# EAGLE design ResolverBoard (EAGLE 9.3.0)
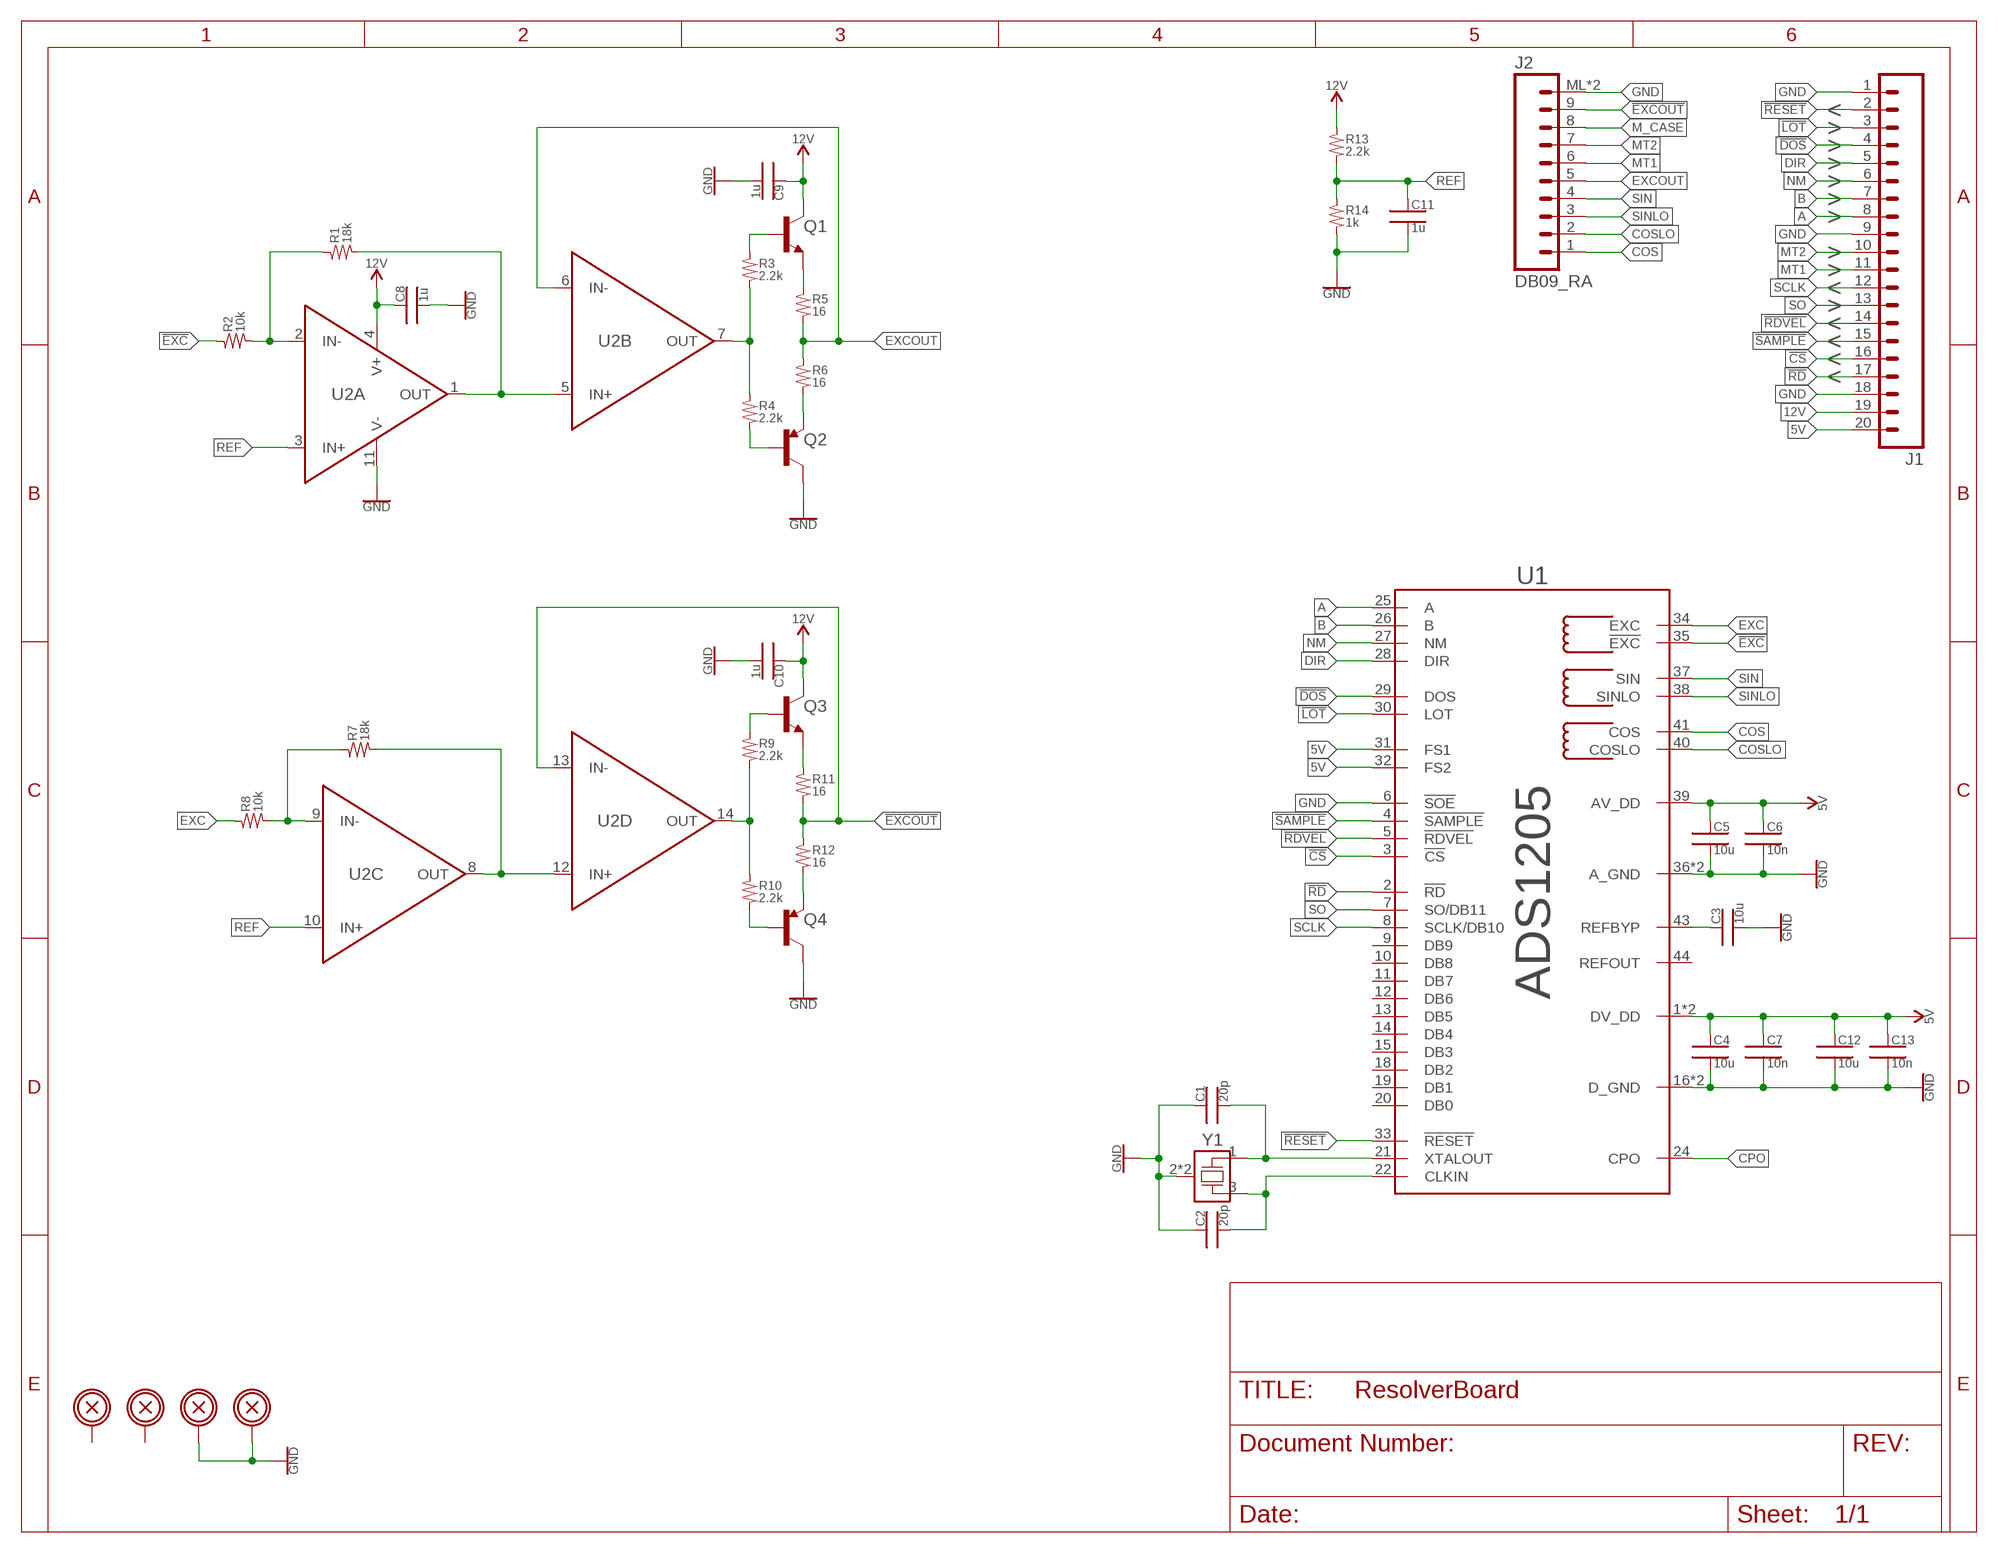
[diagram p0: schematic, sheet 1]

## Parts
C1  20p  CAP_SMD_0402  [0402]
C2  20p  CAP_SMD_0402  [0402]
C3  10u  CAP_SMD_0603  [0603]
C4  10u  CAP_SMD_0603  [0603]
C5  10u  CAP_SMD_0603  [0603]
C6  10n  CAP_SMD_0402  [0402]
C7  10n  CAP_SMD_0402  [0402]
C8  1u  CAP_SMD_0402  [0402]
C9  1u  CAP_SMD_0402  [0402]
C10  1u  CAP_SMD_0402  [0402]
C11  1u  CAP_SMD_0402  [0402]
C12  10u  CAP_SMD_0603  [0603]
C13  10n  CAP_SMD_0402  [0402]
H1  BOLTHOLE_M3  [M3_HOLE]
H2  BOLTHOLE_M3  [M3_HOLE]
H3  BOLTHOLE_M3  [M3_HOLE]
H4  BOLTHOLE_M3  [M3_HOLE]
J1  M20  [1X20]
J2  DB09_RA  [AE10921]
Q1  BJT_NPN  [SOT23-3]
Q2  BJT_PNP  [SOT23-3]
Q3  BJT_NPN  [SOT23-3]
Q4  BJT_PNP  [SOT23-3]
R1  18k  RES_SMD_0402  [0402]
R2  10k  RES_SMD_0402  [0402]
R3  2.2k  RES_SMD_0402  [0402]
R4  2.2k  RES_SMD_0402  [0402]
R5  16  RES_SMD_0805  [0805]
R6  16  RES_SMD_0805  [0805]
R7  18k  RES_SMD_0402  [0402]
R8  10k  RES_SMD_0402  [0402]
R9  2.2k  RES_SMD_0402  [0402]
R10  2.2k  RES_SMD_0402  [0402]
R11  16  RES_SMD_0805  [0805]
R12  16  RES_SMD_0805  [0805]
R13  2.2k  RES_SMD_0402  [0402]
R14  1k  RES_SMD_0402  [0402]
U1  ADS1205  [LQFP44]
U2  OPA4171D  [SOIC_14]
Y1  LFXTAL061486  [5X3.2MM_SMD_XTAL]

## Nets
5V: C4.1 C5.1 C6.1 C7.1 C12.1 C13.1 J1.20 U1.1(DV_DD) U1.17(DV_DD) U1.31(FS1) U1.32(FS2) U1.39(AV_DD)
12V: C8.1 C9.1 C10.1 J1.19 Q1.3(C) Q3.3(C) R13.1 U2.4(A:V+)
!CS: J1.16 U1.3(!CS)
!DOS: J1.4 U1.29(DOS)
!EXC: R2.1 U1.35(!EXC)
!EXCOUT: J2.9 R11.2 R12.1 U2.13(D:IN-)
!LOT: J1.3 U1.30(LOT)
!RD: J1.17 U1.2(!RD)
!RDVEL: J1.14 U1.5(!RDVEL)
!RESET: J1.2 U1.33(!RESET)
!SAMPLE: J1.15 U1.4(!SAMPLE)
A: J1.8 U1.25(A)
B: J1.7 U1.26(B)
CLKIN: C2.2 U1.22(CLKIN) Y1.3(X2)
COS: J2.1 U1.41(COS)
COSLO: J2.2 U1.40(COSLO)
CPO: U1.24(CPO)
DIR: J1.5 U1.28(DIR)
EXC: R8.1 U1.34(EXC)
EXCOUT: J2.5 R5.2 R6.1 U2.6(B:IN-)
GND: C1.1 C2.1 C3.2 C4.2 C5.2 C6.2 C7.2 C8.2 C9.2 C10.2 C11.2 C12.2 C13.2 H3.P H4.P J1.1 J1.9 J1.18 J2.ML J2.MR Q2.3(C) Q4.3(C) R14.2 U1.6(!SOE) U1.16(D_GND) U1.23(D_GND) U1.36(A_GND) U1.42(A_GND) U2.11(A:V-) Y1.2(CASE) Y1.4(CASE)
M_CASE: J2.8
MT1: J1.11 J2.6
MT2: J1.10 J2.7
NM: J1.6 U1.27(NM)
Q1BASE: Q1.1(B) R3.1
Q1EMITTER: Q1.2(E) R5.1
Q2BASE: Q2.1(B) R4.2
Q2EMITTER: Q2.2(E) R6.2
Q3BASE: Q3.1(B) R9.1
Q3EMITTER: Q3.2(E) R11.1
Q4BASE: Q4.1(B) R10.2
Q4EMITTER: Q4.2(E) R12.2
REF: C11.1 R13.2 R14.1 U2.3(A:IN+) U2.10(C:IN+)
REFBYP: C3.1 U1.43(REFBYP)
SCLK: J1.12 U1.8(SCLK/DB10)
SIN: J2.4 U1.37(SIN)
SINLO: J2.3 U1.38(SINLO)
SO: J1.13 U1.7(SO/DB11)
U2A_IN-: R1.1 R2.2 U2.2(A:IN-)
U2A_OUT: R1.2 U2.1(A:OUT) U2.5(B:IN+)
U2B_OUT: R3.2 R4.1 U2.7(B:OUT)
U2C_IN-: R7.1 R8.2 U2.9(C:IN-)
U2C_OUT: R7.2 U2.8(C:OUT) U2.12(D:IN+)
U2D_OUT: R9.2 R10.1 U2.14(D:OUT)
XTALOUT: C1.2 U1.21(XTALOUT) Y1.1(X1)
Unconnected: H1.P H2.P U1.9(DB9) U1.10(DB8) U1.11(DB7) U1.12(DB6) U1.13(DB5) U1.14(DB4) U1.15(DB3) U1.18(DB2) U1.19(DB1) U1.20(DB0) U1.44(REFOUT)

## Notes on the sheet
- <
- >
- >
- >
- >
- >
- >
- >
- >
- <
- >
- <
- <
- <
- <

## Library data of the parts
C1-C13 = FPGA_FOC_lib:CAP_SMD
H1-H4 = FPGA_FOC_lib:BOLTHOLE
J1 = FPGA_FOC_lib:M20
J2 = FPGA_FOC_lib:DB09
Q1 Q3 = FPGA_FOC_lib:BJT_NPN
Q2 Q4 = FPGA_FOC_lib:BJT_PNP: Generic NPN Bipolar transistor
R1-R14 = FPGA_FOC_lib:RES_SMD
U1 = FPGA_FOC_lib:ADS1205: AD2S1205 Resolver decoder
U2 = FPGA_FOC_lib:OPA4171: 36V 3MhzGBP Quad Opamp (datasheet) <http://www.ti.com/lit/ds/symlink/opa4171.pdf>
Y1 = FPGA_FOC_lib:LFXTAL061486: 8.192 MHz crystal, load cap=10pf (2x20pf), (datasheet) <https://www.iqdfrequencyproducts.com/products/pn/LFXTAL061486Reel.pdf>

## Board
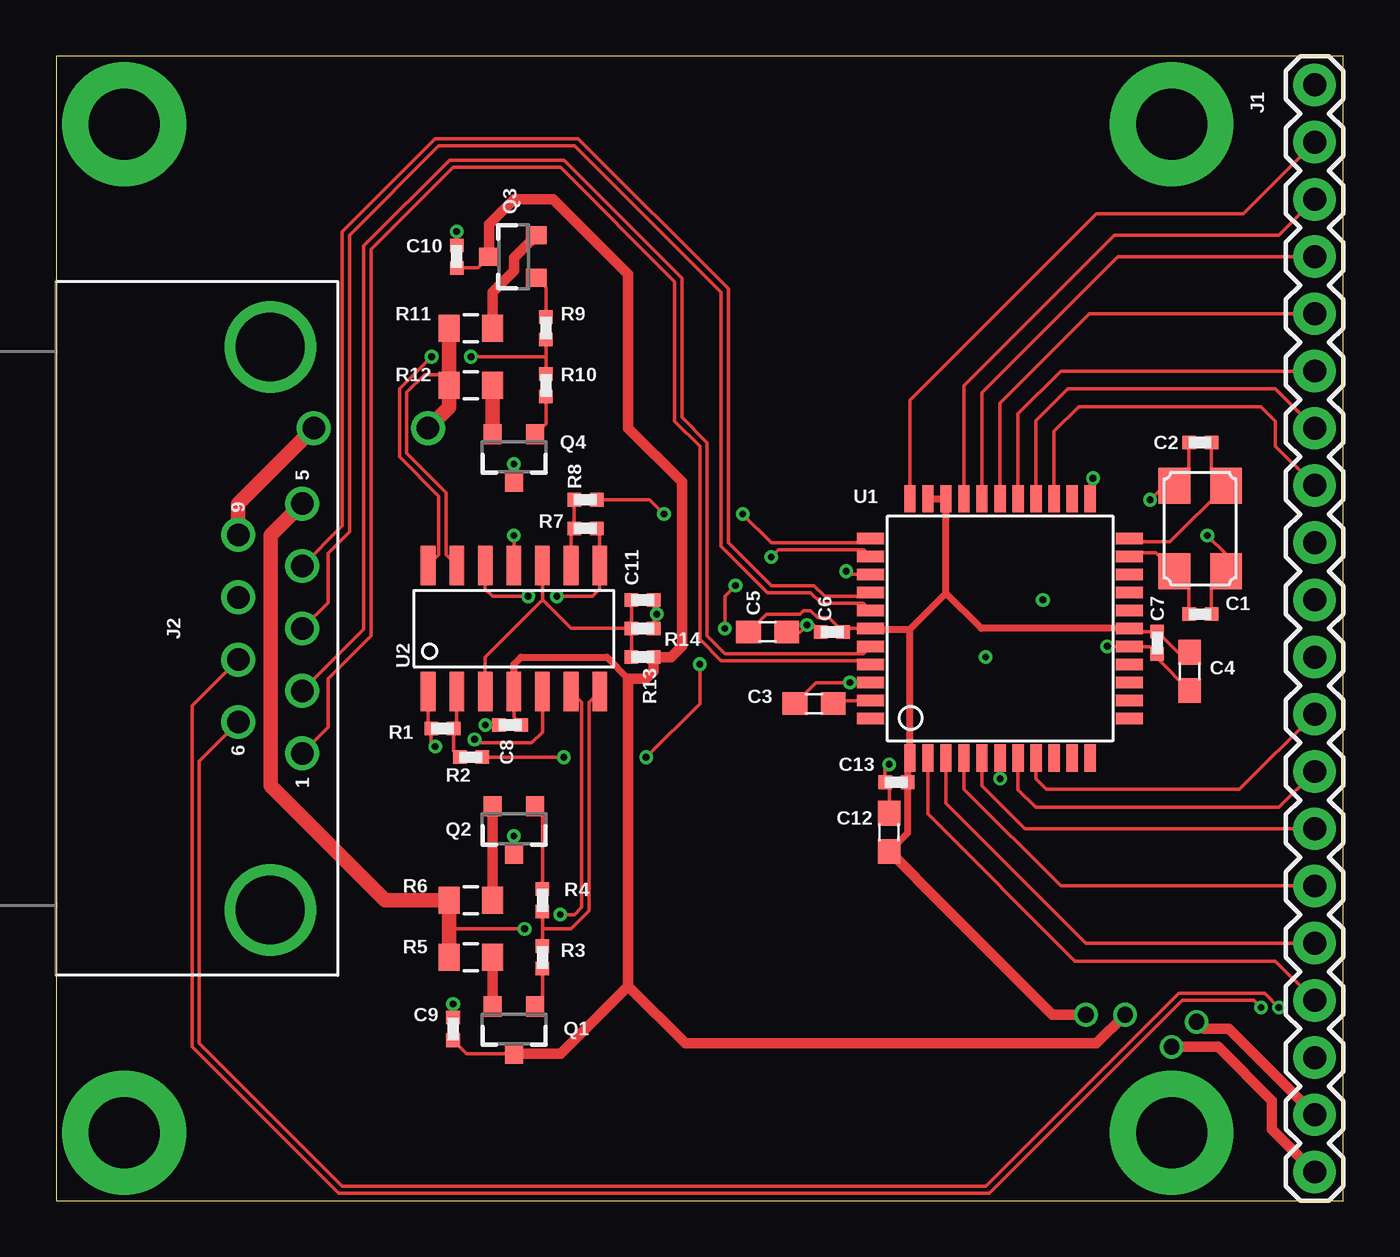
[diagram p1: board, top side]
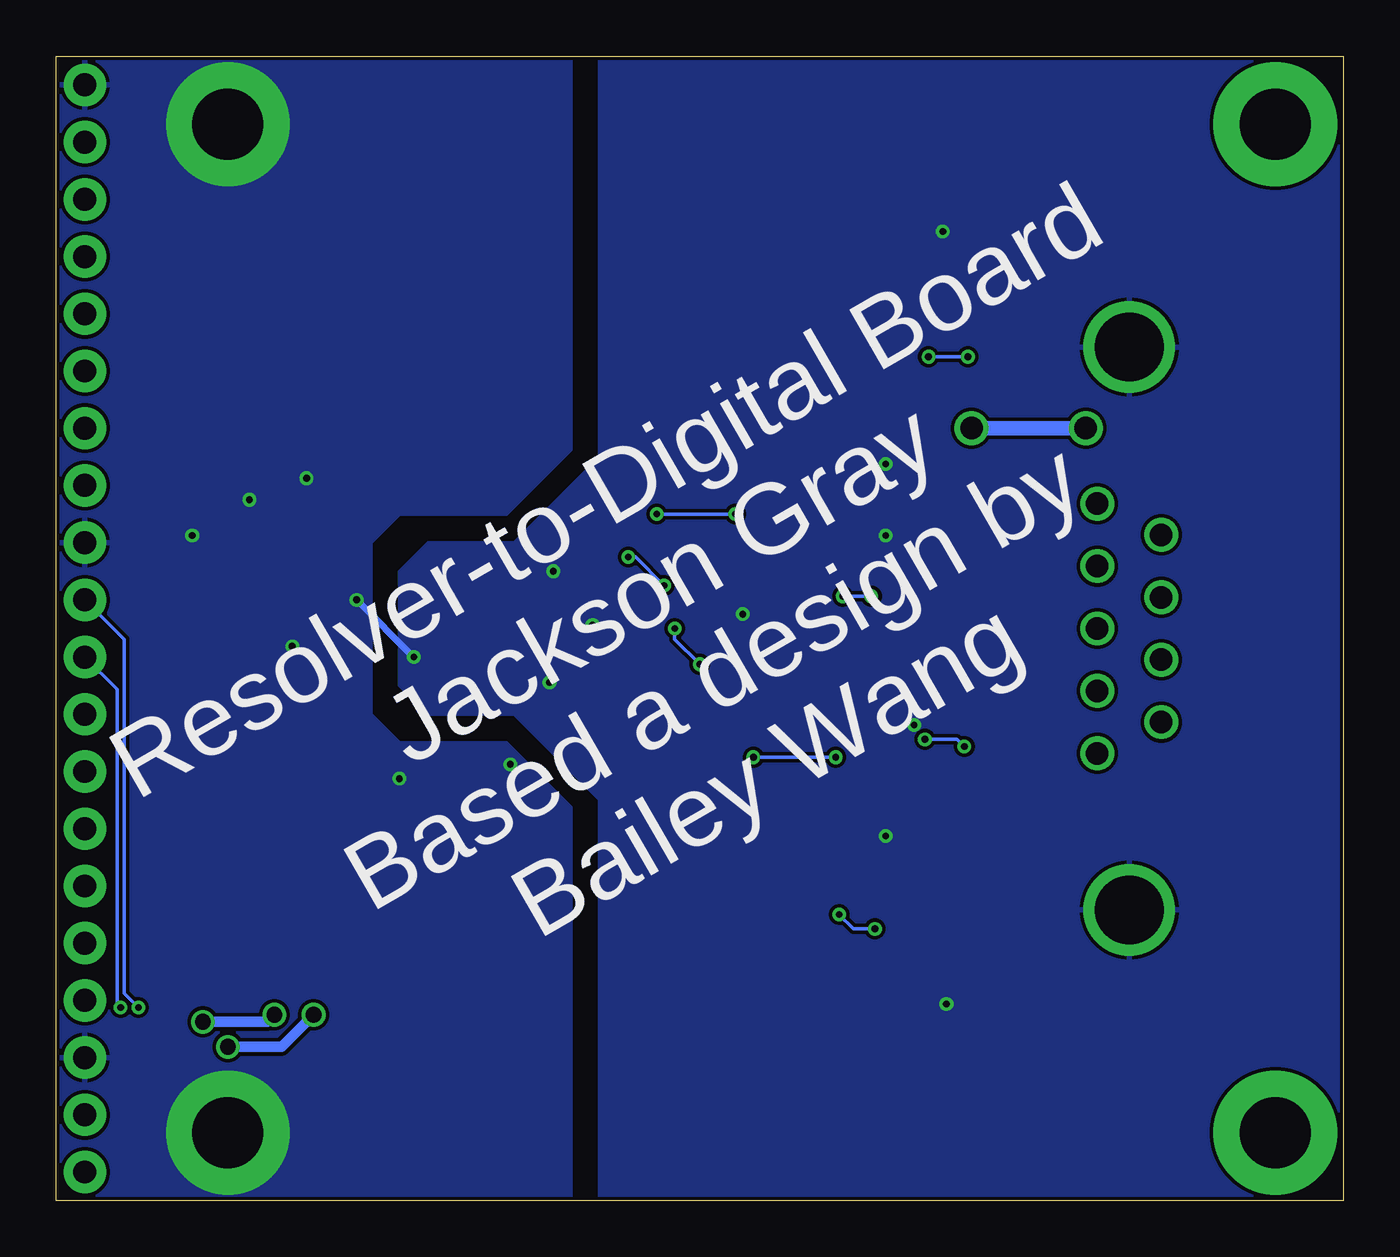
[diagram p2: board, bottom side, seen from below]

Size 57.15 x 50.8 mm. Coordinates in mm from the lower left corner, seen from the top.
Outline: 0,0 57.15,0 57.15,50.8 0,50.8 0,0
Copper layers (1*16): Top 0.035mm / dielectric 1.5mm / Bottom 0.035mm
Design rules "3PCB_2layer": minimum track width 6mil, minimum drill 0.3mm, track to track 6mil, track to pad 6mil, pad to pad 6mil, via to via 6mil, smd to smd 0mil, copper to edge 6mil, drill to drill 6mil, minimum pad ring 6mil, minimum via ring 6mil, stop-mask expansion 2mil, vias tented up to drill 0.3mm, thermal gap 6.25mil

### Footprints (pad centres in the part's own frame; a part is rotated, then mirrored left to right if it is on the bottom)
0402 = smd 0.6 x 0.6: 1 -0.5,0; 2 0.5,0
0603 = smd 1.1 x 1: 1 -0.85,0; 2 0.85,0
M3_HOLE = drill 3.15 pad 5.5: P 0,0
1X20 = drill 1.016 pad 1.88: 1 0,0; 2 2.54,0; 3 5.08,0; 4 7.62,0; 5 10.16,0; 6 12.7,0; 7 15.24,0; 8 17.78,0; 9 20.32,0; 10 22.86,0; 11 25.4,0; 12 27.94,0; 13 30.48,0; 14 33.02,0; 15 35.56,0; 16 38.1,0; 17 40.64,0; 18 43.18,0; 19 45.72,0; 20 48.26,0
AE10921 = drill 1: 1 5.54,10.92; 2 2.77,10.92; 3 0,10.92; 4 -2.77,10.92; 5 -5.54,10.92; 6 4.155,8.08; 7 1.385,8.08; 8 -1.385,8.08; 9 -4.155,8.08 | drill 3.05: ML -12.495,9.5; MR 12.495,9.5
SOT23-3 = smd 0.8 x 0.9: 1 -0.95,-1; 2 0.95,-1; 3 0,1.1
0805 = smd 0.927 x 1.2: 1 -0.964,0; 2 0.964,0
LQFP44 = smd 1.2 x 0.5: 1 -5.75,4; 2 -5.75,3.2; 3 -5.75,2.4; 4 -5.75,1.6; 5 -5.75,0.8; 6 -5.75,0; 7 -5.75,-0.8; 8 -5.75,-1.6; 9 -5.75,-2.4; 10 -5.75,-3.2; 11 -5.75,-4; 23 5.75,-4; 24 5.75,-3.2; 25 5.75,-2.4; 26 5.75,-1.6; 27 5.75,-0.8; 28 5.75,0; 29 5.75,0.8; 30 5.75,1.6; 31 5.75,2.4; 32 5.75,3.2; 33 5.75,4 | smd 0.5 x 1.2: 12 -4,-5.75; 13 -3.2,-5.75; 14 -2.4,-5.75; 15 -1.6,-5.75; 16 -0.8,-5.75; 17 0,-5.75; 18 0.8,-5.75; 19 1.6,-5.75; 20 2.4,-5.75; 21 3.2,-5.75; 22 4,-5.75; 34 4,5.75; 35 3.2,5.75; 36 2.4,5.75; 37 1.6,5.75; 38 0.8,5.75; 39 0,5.75; 40 -0.8,5.75; 41 -1.6,5.75; 42 -2.4,5.75; 43 -3.2,5.75; 44 -4,5.75
SOIC_14 = smd 1.75 x 0.65: 1 -2.8,3.81; 2 -2.8,2.54; 3 -2.8,1.27; 4 -2.8,0; 5 -2.8,-1.27; 6 -2.8,-2.54; 7 -2.8,-3.81; 8 2.8,-3.81; 9 2.8,-2.54; 10 2.8,-1.27; 11 2.8,0; 12 2.8,1.27; 13 2.8,2.54; 14 2.8,3.81
5X3.2MM_SMD_XTAL = smd 1.6 x 1.4: 1 -1.9,1.15; 2 1.9,1.15; 3 1.9,-1.15; 4 -1.9,-1.15

### Placement (x,y rotation side)
C1  50.8,26.04 180 top
C2  50.8,33.66 0 top
C3  33.66,22.07 180 top
C4  50.32,23.5 270 top
C5  31.59,25.24 0 top
C6  34.45,25.24 180 top
C7  48.9,24.77 270 top
C8  20.16,21.11 180 top
C9  17.62,7.62 90 top
C10  17.78,41.91 90 top
C11  26.04,26.67 0 top
C12  36.99,16.35 90 top
C13  37.31,18.57 180 top
H1  3.02,3.02 0 top
H2  3.02,47.78 0 top
H3  49.53,47.78 0 top
H4  49.53,3.02 0 top
J1  55.88,49.53 270 top
J2  0,25.4 270 top
Q1  20.32,7.62 180 top
Q2  20.32,16.51 180 top
Q3  20.32,41.91 90 top
Q4  20.32,33.02 180 top
R1  17.14,20.95 180 top
R2  18.41,19.68 180 top
R3  21.59,10.79 90 top
R4  21.59,13.34 90 top
R5  18.41,10.79 180 top
R6  18.41,13.34 0 top
R7  23.5,29.84 0 top
R8  23.5,31.11 180 top
R9  21.75,38.73 270 top
R10  21.75,36.2 270 top
R11  18.41,38.73 180 top
R12  18.41,36.2 0 top
R13  26.04,24.13 180 top
R14  26.04,25.4 0 top
U1  41.91,25.4 90 top
U2  20.32,25.4 90 top
Y1  50.8,29.84 90 top

### Tracks (layer width: path | path; a pad name or v marks a point on that pad's centre or on a via)
5V  (via drill 0.7)
  Top 0.159: C5.1 31.54,26.04 33.02,26.04 33.18,26.19 33.5,26.19 33.81,25.88 34.31,25.88 C6.1 35.11,25.4 U1.39 | U1.17 47.8,25.27 C7.1 49.81,24.34 C4.1
  Top 0.318: C12.1 37.81,16.32 C13.1 37.81,19.55 U1.1 37.91,25.37 | 37.91,25.37 38.02,25.48 39.51,26.97 | U1.39 36.19,25.37 37.91,25.37 | 39.51,26.97 U1.31 U1.32 | U1.17 41.08,25.4 39.51,26.97
  Top 0.476: J1.20 53.98,3.17 53.98,4.45 51.59,6.83 v49.53,6.83 | C12.1 39.37,13.12 44.23,8.26 v45.72,8.26
  Bottom 0.476: v49.53,6.83 47.15,6.83 v45.72,8.26
12V  (via drill 0.7)
  Top 0.159: U2.4 20.32,21.45 C8.1 | Q1.3 20.16,6.52 18.22,6.52 C9.1 | Q3.3 18.72,41.41 C10.1
  Top 0.318: U2.4 20.32,23.81 20.64,24.13 24.45,24.13 25.4,23.18 | 26.51,24.11 R13.1
  Top 0.476: 25.4,9.53 25.4,23.18 26.19,23.18 26.51,23.5 26.51,24.11 | 20.16,6.52 22.39,6.52 25.4,9.53 | R13.1 27.3,24.13 27.78,24.61 27.78,31.91 25.4,34.29 25.4,41.12 22.07,44.45 20.32,44.45 19.22,43.35 Q3.3 | J1.19 52.07,7.62 50.96,7.62 v50.64,7.94 | v47.47,8.26 46.2,6.99 27.94,6.99 25.4,9.53
  Bottom 0.476: v50.64,7.94 47.78,7.94 v47.47,8.26
!CS
  Top 0.159: U1.3 39.51,17.64 45.72,11.43 J1.16
!DOS
  Top 0.159: U1.29 41.11,35.87 47.15,41.91 J1.4
!EXC  (via drill 0.3)
  Top 0.159: U1.35 35.87,28.89 32.07,28.89 v31.75,28.57 | R2.1 v22.54,19.68 | v26.19,19.68 28.57,22.07 v28.57,23.81 | v29.69,25.4 29.69,26.83 v30.16,27.3
  Bottom 0.159: v22.54,19.68 v26.19,19.68 | v28.57,23.81 29.69,24.92 v29.69,25.4 | v30.16,27.3 31.43,28.57 v31.75,28.57
!EXCOUT  (via drill 1)
  Top 0.159: U2.13 17.3,28.68 17.3,31.43 15.56,33.18 15.56,35.88 16.35,36.67 16.98,36.67 R12.1
  Top 0.635: R11.2 R12.1 17.45,35.23 v16.51,34.29 | J2.9 8.08,30.94 v11.43,34.29
  Bottom 0.635: v11.43,34.29 v16.51,34.29
!LOT
  Top 0.159: U1.30 40.31,36.18 46.99,42.86 54.29,42.86 J1.3
!RD
  Top 0.159: U1.2 38.71,17.17 45.24,10.64 54.13,10.64 J1.17
!RDVEL
  Top 0.159: U1.5 41.11,18.42 43.02,16.51 J1.14
!RESET
  Top 0.159: J1.2 52.7,43.81 46.2,43.81 37.91,35.53 U1.33
!SAMPLE
  Top 0.159: J1.15 44.61,13.97 40.31,18.27 U1.4
A
  Top 0.159: U1.25 44.31,34.15 45.4,35.24 53.5,35.24 54.13,34.61 54.13,33.5 J1.8
B
  Top 0.159: J1.7 54.13,36.04 44.93,36.04 43.51,34.62 U1.26
CLKIN
  Top 0.159: C2.2 51.3,32.4 Y1.3 49.45,29.24 47.82,29.24 U1.22
COS
  Top 0.159: J2.1 12.06,21 12.06,23.18 13.97,25.08 13.97,42.23 17.62,45.88 22.38,45.88 27.46,40.8 27.46,34.61 28.57,33.5 28.57,24.92 29.53,23.97 35.99,23.97 U1.41
COSLO
  Top 0.159: J2.2 13.65,25.36 13.65,42.39 17.46,46.2 22.54,46.2 27.78,40.96 27.78,34.77 28.89,33.66 28.89,25.08 29.69,24.29 35.85,24.29 U1.40
DIR
  Top 0.159: U1.28 41.91,35.4 45.88,39.37 J1.5
EXC  (via drill 0.3)
  Top 0.159: U1.34 35.97,29.21 31.75,29.21 v30.48,30.48 | v26.99,30.48 26.35,31.11 R8.1
  Bottom 0.159: v30.48,30.48 v26.99,30.48
EXCOUT  (via drill 0.3)
  Top 0.159: U2.6 23.34,22.12 23.34,13.02 23.02,12.7 v22.38,12.7 | v20.8,12.06 17.45,12.06
  Top 0.318: 17.45,11.43 R5.2
  Top 0.635: 17.45,11.43 17.45,12.06 R6.1 14.61,13.34 9.53,18.41 9.53,29.55 J2.5
  Bottom 0.159: v22.38,12.7 21.75,12.06 v20.8,12.06
GND  (via drill 0.3)
  Top 0.159: v20.32,29.53 U2.11 | C8.2 v19.05,21.11 | C9.2 v17.62,8.73 | C10.2 v17.78,43.02 | U1.42 v35.24,23 33.74,23 C3.2 | R14.2 26.54,25.9 v26.67,26.04 26.54,26.17 C11.2 | C12.2 36.99,18.39 C13.2 36.81,19.18 v36.99,19.37 | C2.1 50.3,32.4 Y1.2 49.21,31.75 v48.58,31.11 | C1.1 51.3,27.3 Y1.4 51.95,28.7 v51.12,29.53 | C6.2 33.63,25.56 v33.34,25.56 33.02,25.24 C5.2 | U1.23 45.91,31.94 v46.04,32.07 | v46.67,24.61 v46.68,24.6 U1.16 48.56,24.6 C7.2 48.9,24.07 C4.2 | v41.91,18.73 U1.6 | U1.36 35.22,27.8 v35.08,27.94
  Top 0.318: Q2.3 v20.32,16.19
  Top 0.476: Q4.3 v20.32,32.7
  Bottom 0.318: v41.27,24.13 v43.81,26.67
  pour Bottom (isolate 0.159, rank 4): -1.27,-1.27 -1.27,52.07 33.02,52.07 33.02,-1.27
  pour Bottom (isolate 0.159): 58.42,-1.27 34.29,-1.27 34.29,17.46 37.15,20.32 41.91,20.32 43.18,21.59 43.18,29.21 41.91,30.48 37.15,30.48 34.29,33.34 34.29,52.07 58.42,52.07
  pour Bottom (isolate 0.159): 40.64,29.21 36.83,29.21 30.48,35.56 30.48,15.24 36.83,21.59 40.64,21.59 41.91,22.86 41.91,27.94
MT1  (via drill 0.3)
  Top 0.159: J2.6 6.35,19.52 6.35,6.99 12.7,0.64 41.27,0.64 49.85,9.21 53.66,9.21 v54.29,8.57
  Bottom 0.159: J1.11 54.45,22.7 54.45,8.73 v54.29,8.57
MT2  (via drill 0.3)
  Top 0.159: J2.7 6.03,21.97 6.03,6.83 12.54,0.32 41.43,0.32 50.01,8.89 53.18,8.89 v53.5,8.57
  Bottom 0.159: J1.10 54.13,24.92 54.13,9.21 v53.5,8.57
NM
  Top 0.159: U1.27 42.71,34.93 44.61,36.83 J1.6
Q1BASE
  Top 0.159: Q1.1 21.59,8.94 R3.1
Q1EMITTER
  Top 0.318: Q1.2
  Top 0.476: R5.1 Q1.2
Q2BASE
  Top 0.159: Q2.1 21.59,17.19 R4.2
Q2EMITTER
  Top 0.318: R6.2
  Top 0.476: Q2.2 R6.2
Q3BASE
  Top 0.159: Q3.1 21.75,40.53 R9.1
Q3EMITTER
  Top 0.476: Q3.2 20.32,41.86 20.32,41.27 19.38,40.33 R11.1
Q4BASE
  Top 0.159: R10.2 21.75,34.5 Q4.1
Q4EMITTER
  Top 0.318: 19.37,36.19 R12.2
  Top 0.635: Q4.2 19.37,36.19
REF
  Top 0.159: 21.59,26.67 19.05,24.13 U2.3 | R14.1 22.86,25.4 21.59,26.67 | C11.1 R14.1 | R13.2 R14.1 | 21.59,26.67 U2.10
REFBYP
  Top 0.159: U1.43 34.64,22.2 C3.1
SCLK
  Top 0.159: J1.12 52.55,18.26 43.97,18.26 43.51,18.72 U1.8
SIN
  Top 0.159: J2.4 12.7,29.95 12.7,43.02 16.83,47.15 23.18,47.15 29.84,40.48 29.84,29.21 31.75,27.3 33.66,27.3 34.13,26.83 35.99,26.83 U1.37
SINLO
  Top 0.159: J2.3 12.06,26.55 12.06,28.73 13.02,29.69 13.02,42.86 16.99,46.83 23.02,46.83 29.53,40.32 29.53,29.05 31.59,26.99 33.5,26.99 33.97,26.51 35.85,26.51 U1.38
SO
  Top 0.159: U1.7 42.71,18.25 43.5,17.46 54.29,17.46 J1.13
U2A_IN-
  Top 0.159: U2.2 17.78,21.09 R1.1 17.64,19.95 R2.2
U2A_OUT  (via drill 0.3)
  Top 0.159: U2.5 21.59,20.8 21.11,20.32 18.73,20.32 v18.57,20.48 | v16.83,20.16 16.64,20.34 R1.2 16.51,21.09 U2.1
  Bottom 0.159: v18.57,20.48 17.14,20.48 v16.83,20.16
U2B_OUT
  Top 0.159: R4.1 21.59,12.06 | 21.59,12.06 R3.2 | U2.7 23.65,22.12 23.65,12.86 22.86,12.06 21.59,12.06
U2C_IN-
  Top 0.159: U2.9 22.86,29.71 R7.1 R8.2
U2C_OUT  (via drill 0.3)
  Top 0.159: R7.2 24.13,29.71 U2.8 24.13,27.15 23.81,26.83 v22.23,26.83 | U2.12 19.05,27.15 19.37,26.83 v20.95,26.83
  Bottom 0.159: v20.95,26.83 v22.23,26.83
U2D_OUT  (via drill 0.3)
  Top 0.159: U2.14 16.99,28.68 16.99,31.27 15.24,33.02 15.24,36.04 v16.67,37.47 | R10.1 21.75,37.47 | 21.75,37.47 R9.2 | v18.41,37.47 21.75,37.47
  Bottom 0.159: v16.67,37.47 v18.41,37.47
XTALOUT
  Top 0.159: C1.2 50.3,27.3 Y1.1 48.84,28.76 47.82,28.76 U1.21

### Text on the board
bPlace: Resolver-to-Digital Board / Jackson Gray / Based a design by / Bailey Wang